# EAGLE design Power_cape (EAGLE 7.1.0)

## Sheet 1 of 3
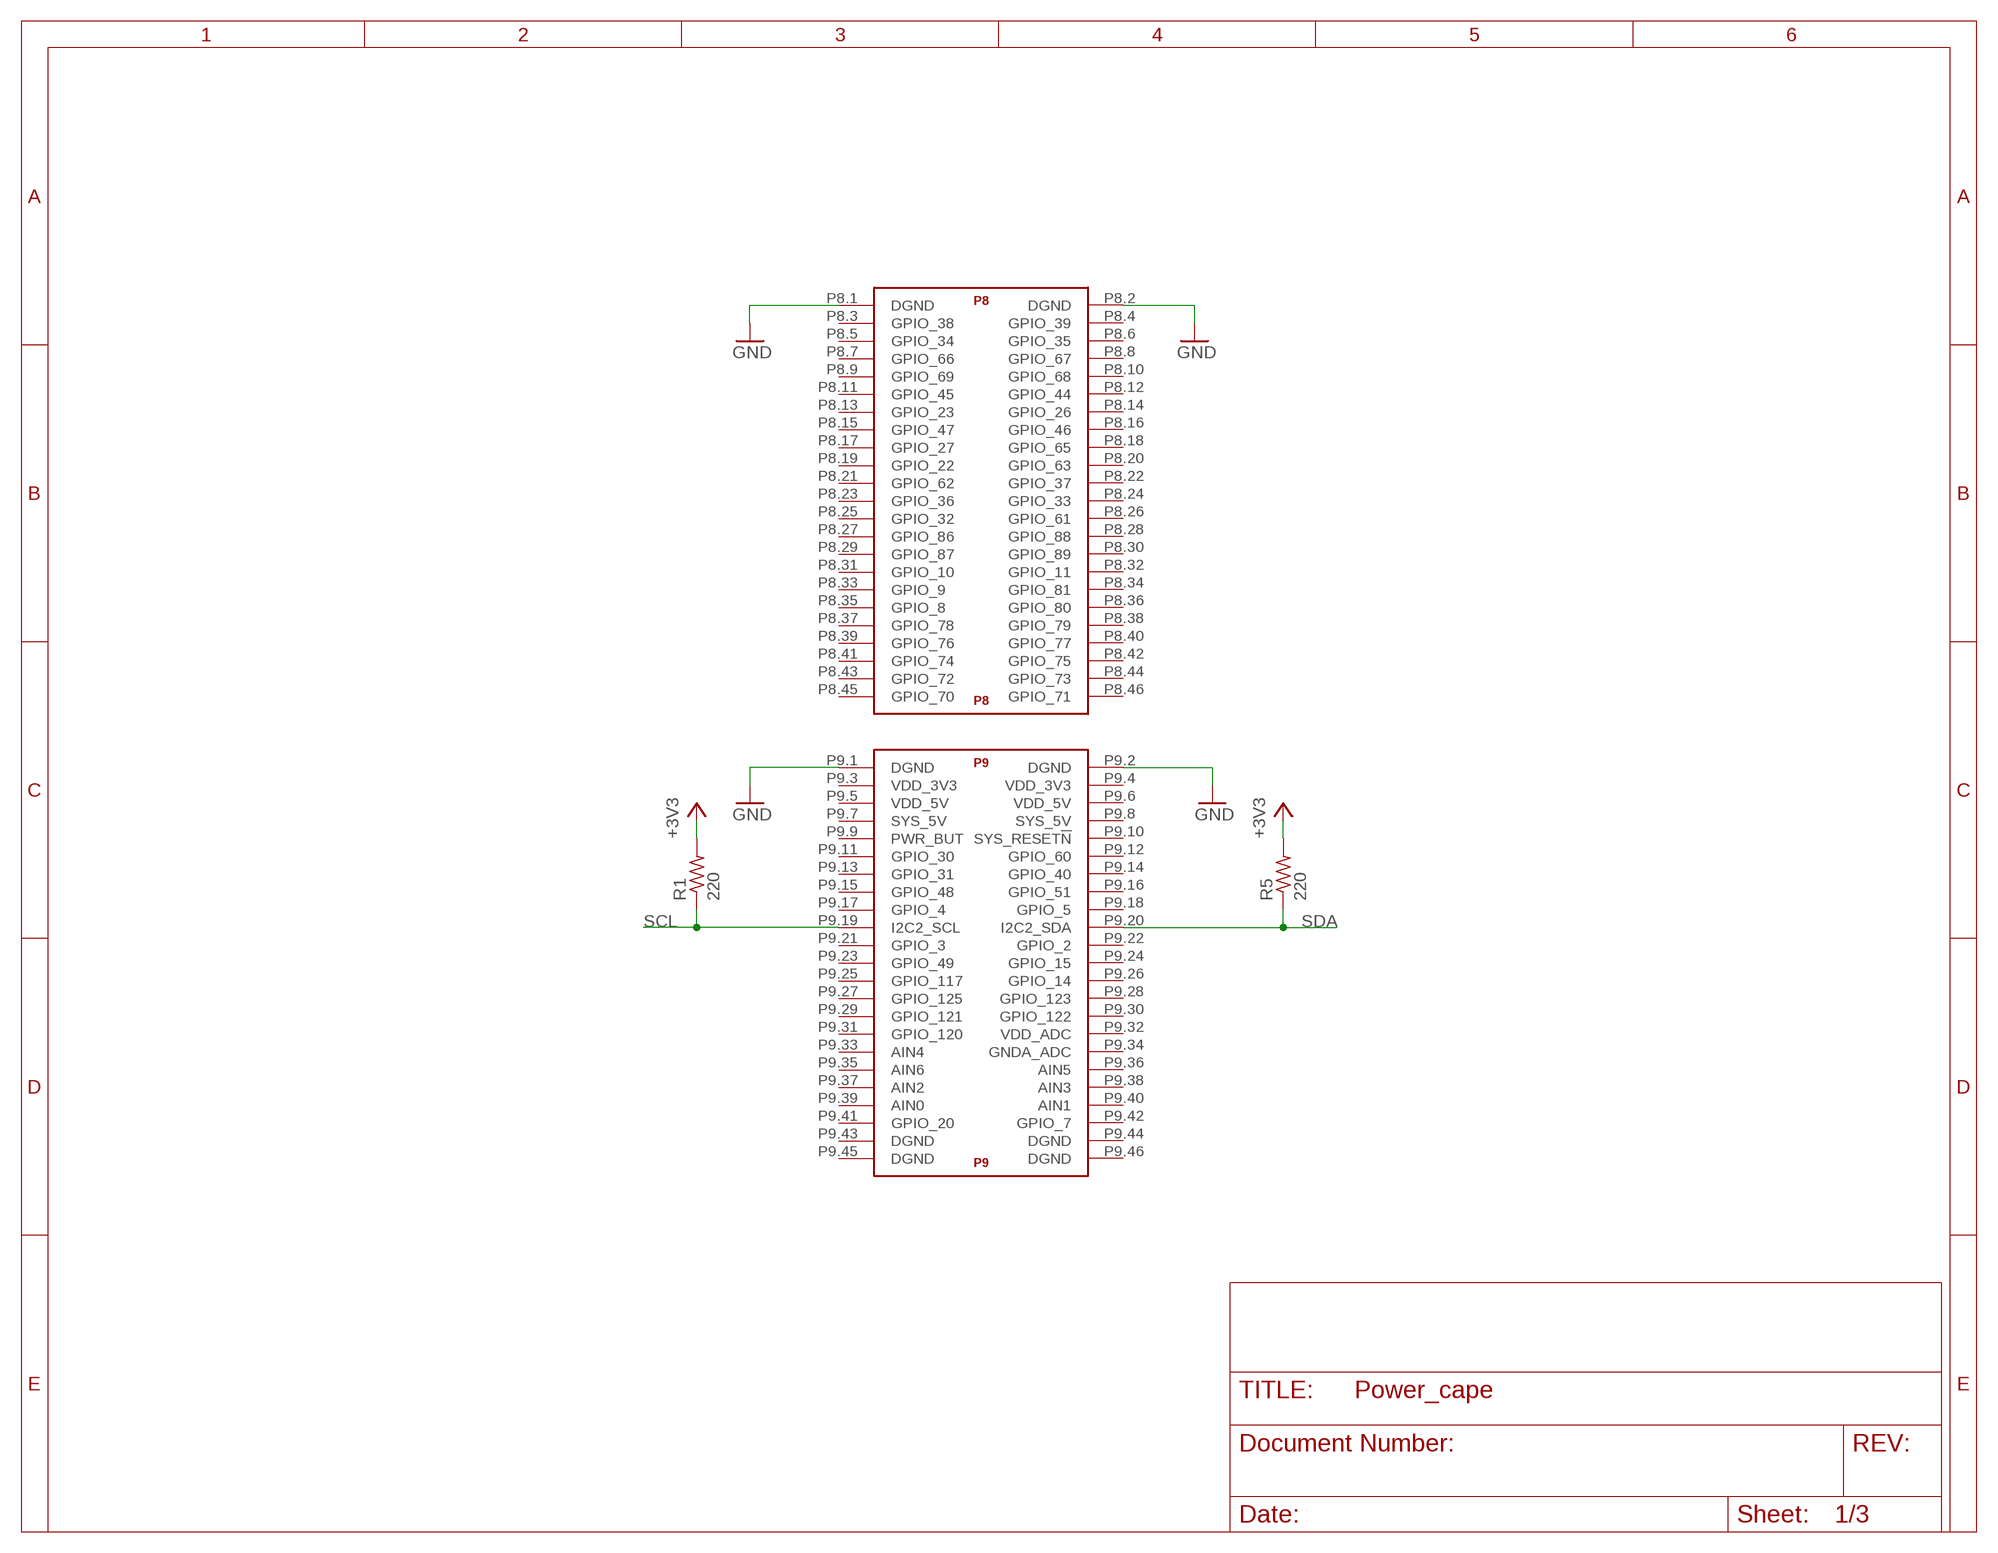
[diagram p0: schematic, sheet 1]

### Parts
R1  220  R-US_R0805W  [R0805W]
R5  220  R-US_R0805W  [R0805W]
U$1  BEAGLE_BONE_BLACK_CAPE  [BEAGLE_BONE_BLACK_CAPE]

### Nets
+3V3: R1.2 R5.2
GND: U$1.P8.1(P8:DGND) U$1.P8.2(P8:DGND) U$1.P9.1(P9:DGND) U$1.P9.2(P9:DGND) ; also sheet 2
SCL: R1.1 U$1.P9.19(P9:I2C2_SCL)
SDA: R5.1 U$1.P9.20(P9:I2C2_SDA)
Unconnected: U$1.P8.3(P8:GPIO_38) U$1.P8.4(P8:GPIO_39) U$1.P8.5(P8:GPIO_34) U$1.P8.6(P8:GPIO_35) U$1.P8.7(P8:GPIO_66) U$1.P8.8(P8:GPIO_67) U$1.P8.9(P8:GPIO_69) U$1.P8.10(P8:GPIO_68) U$1.P8.11(P8:GPIO_45) U$1.P8.12(P8:GPIO_44) U$1.P8.13(P8:GPIO_23) U$1.P8.14(P8:GPIO_26) U$1.P8.15(P8:GPIO_47) U$1.P8.16(P8:GPIO_46) U$1.P8.17(P8:GPIO_27) U$1.P8.18(P8:GPIO_65) U$1.P8.19(P8:GPIO_22) U$1.P8.20(P8:GPIO_63) U$1.P8.21(P8:GPIO_62) U$1.P8.22(P8:GPIO_37) U$1.P8.23(P8:GPIO_36) U$1.P8.24(P8:GPIO_33) U$1.P8.25(P8:GPIO_32) U$1.P8.26(P8:GPIO_61) U$1.P8.27(P8:GPIO_86) U$1.P8.28(P8:GPIO_88) U$1.P8.29(P8:GPIO_87) U$1.P8.30(P8:GPIO_89) U$1.P8.31(P8:GPIO_10) U$1.P8.32(P8:GPIO_11) U$1.P8.33(P8:GPIO_9) U$1.P8.34(P8:GPIO_81) U$1.P8.35(P8:GPIO_8) U$1.P8.36(P8:GPIO_80) U$1.P8.37(P8:GPIO_78) U$1.P8.38(P8:GPIO_79) U$1.P8.39(P8:GPIO_76) U$1.P8.40(P8:GPIO_77) U$1.P8.41(P8:GPIO_74) U$1.P8.42(P8:GPIO_75) U$1.P8.43(P8:GPIO_72) U$1.P8.44(P8:GPIO_73) U$1.P8.45(P8:GPIO_70) U$1.P8.46(P8:GPIO_71) U$1.P9.3(P9:VDD_3V3) U$1.P9.4(P9:VDD_3V3) U$1.P9.5(P9:VDD_5V) U$1.P9.6(P9:VDD_5V) U$1.P9.7(P9:SYS_5V) U$1.P9.8(P9:SYS_5V) U$1.P9.9(P9:PWR_BUT) U$1.P9.10(P9:SYS_RESET!N) U$1.P9.11(P9:GPIO_30) U$1.P9.12(P9:GPIO_60) U$1.P9.13(P9:GPIO_31) U$1.P9.14(P9:GPIO_40) U$1.P9.15(P9:GPIO_48) U$1.P9.16(P9:GPIO_51) U$1.P9.17(P9:GPIO_4) U$1.P9.18(P9:GPIO_5) U$1.P9.21(P9:GPIO_3) U$1.P9.22(P9:GPIO_2) U$1.P9.23(P9:GPIO_49) U$1.P9.24(P9:GPIO_15) U$1.P9.25(P9:GPIO_117) U$1.P9.26(P9:GPIO_14) U$1.P9.27(P9:GPIO_125) U$1.P9.28(P9:GPIO_123) U$1.P9.29(P9:GPIO_121) U$1.P9.30(P9:GPIO_122) U$1.P9.31(P9:GPIO_120) U$1.P9.32(P9:VDD_ADC) U$1.P9.33(P9:AIN4) U$1.P9.34(P9:GNDA_ADC) U$1.P9.35(P9:AIN6) U$1.P9.36(P9:AIN5) U$1.P9.37(P9:AIN2) U$1.P9.38(P9:AIN3) U$1.P9.39(P9:AIN0) U$1.P9.40(P9:AIN1) U$1.P9.41(P9:GPIO_20) U$1.P9.42(P9:GPIO_7) U$1.P9.43(P9:DGND) U$1.P9.44(P9:DGND) U$1.P9.45(P9:DGND) U$1.P9.46(P9:DGND)

## Sheet 2 of 3
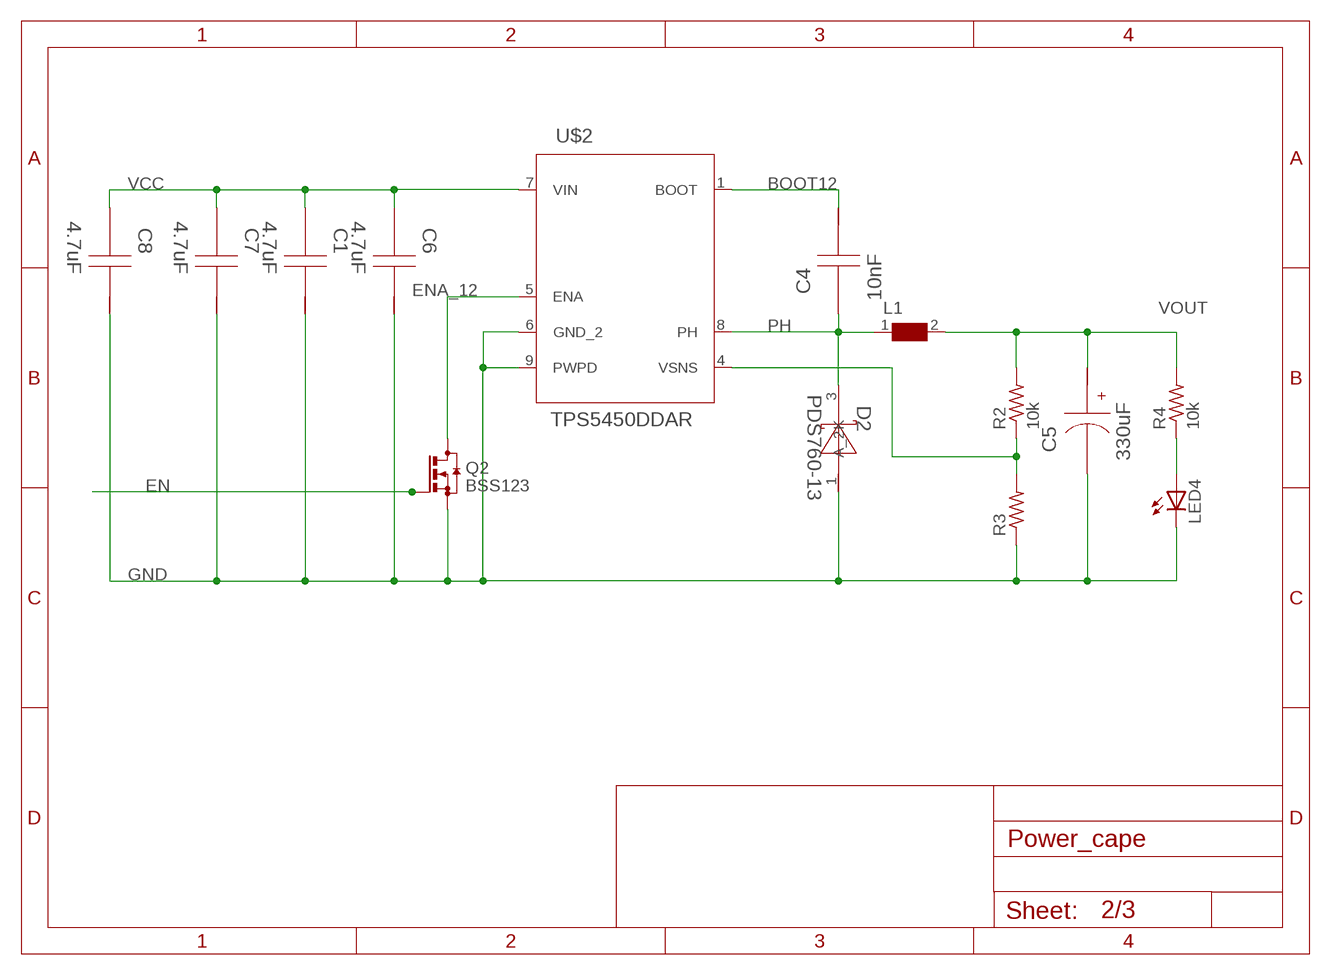
[diagram p1: schematic, sheet 2]

### Parts
C1  4.7uF  GRM31CR71H475KA12L  [1206]
C4  10nF  C0805C103K5RACTU  [0805]
C5  330uF  10SVP330MX  [SM_RADIAL_10AMM]
C6  4.7uF  GRM31CR71H475KA12L  [1206]
C7  4.7uF  GRM31CR71H475KA12L  [1206]
C8  4.7uF  GRM31CR71H475KA12L  [1206]
D2  PDS760-13  [POWERDI5]
L1  WE-HCC-7443331000_1090  [WE-HCC_1090]
LED4  LEDSML1206  [SML1206]
Q2  BSS123  [SOT23]
R2  10k  R-US_R1206  [R1206]
R3  R-US_R1206  [R1206]
R4  10k  R-US_R1206  [R1206]
U$2  TPS5450DDAR  [R-PDSO-G8]

### Nets
BOOT12: C4.1 U$2.1(BOOT)
EN: Q2.1(G)
ENA_12: Q2.3(D) U$2.5(ENA)
GND: C1.1 C5.2(-) C6.1 C7.1 C8.1 D2.1(A_2) LED4.C Q2.2(S) R3.1 U$2.6(GND_2) U$2.9(PWPD) ; also sheet 1
N$1: LED4.A R4.1
PH: C4.2 D2.3(K) L1.1 U$2.8(PH)
VCC: C1.2 C6.2 C7.2 C8.2 U$2.7(VIN)
VOUT: C5.1(+) L1.2 R2.2 R4.2
VSNS12: R2.1 R3.2 U$2.4(VSNS)

## Sheet 3 of 3

## Library data of the parts
C1 C6-C8 = 5v:GRM31CR71H475KA12L; CAP: 4.7E-6; ESR: 0.0; IRMS: 0.0; MANUFACTURER_NAME: MuRata; MANUFACTURER_PART_NUMBER: GRM31CR71H475KA12L; VDC: 50.0; VENDOR: MuRata
C4 = 5v:C0805C103K5RACTU; CAP: 1.0E-8; ESR: 1.739; IRMS: 0.411; MANUFACTURER_NAME: Kemet; MANUFACTURER_PART_NUMBER: C0805C103K5RACTU; VDC: 50.0; VENDOR: Kemet
C5 = 5v:10SVP330MX; CAP: 3.3E-4; DATASHEETURL: http://www.edc.sanyo.com/english/pdf/oscon/E32.pdf; ESR: 0.025; IRMS: 3.7; MANUFACTURER_NAME: Panasonic; MANUFACTURER_PART_NUMBER: 10SVP330MX; VDC: 10.0; VENDOR: Panasonic
D2 = 5v:PDS760-13; DATASHEETURL: www.diodes.com/datasheets/ds30477.pdf; IO: 7.0; MANUFACTURER_NAME: Diodes Inc.; MANUFACTURER_PART_NUMBER: PDS760-13; VENDOR: Diodes Inc.; VFATIO: 0.56; VRRM: 60.0
L1 = WE-HCC:WE-HCC: SMD High Current Cube Inductor WE-HCC - magnetically shieled - current capability up to 27A - excellent saturation characteristics -- filter choke for DC/DC converter -- single and polyphase buck converter -- filter choke for motor electronics; MPN: 7443331000; OC_FARNELL: 1848254; OC_NEWARK: 13T9771; PACKAGE: 1090; SUPPLIER: Wuerth Elektronik
LED4 = led:LED: LED OSRAM: - CHIPLED LG R971, LG N971, LY N971, LG Q971, LY Q971, LO R971, LY R971 LH N974, LH R974 LS Q976, LO Q976, LY Q976 LO Q996 - Hyper CHIPLED LW Q18S LB Q993, LB Q99A, LB R99A - SideLED LS A670, LO A670, LY A670, LG A670, LP A670 LB A673, LV A673, LT A673, LW A673 LH A674 LY A675 LS A676, LA A676, LO A676, LY A676, LW A676 LS A679, LY A679, LG A679 - Hyper Micro SIDELED® LS Y876, LA Y876, LO Y876, LY Y876 LT Y87S - SmartLED LW L88C, LW L88S LB L89C, LB L89S, LG L890 LS L89K, LO L89K, LY L89K LS L896, LA L896, LO L896, LY L896 - TOPLED LS T670, LO T670, LY T670, LG T670, LP T670 LSG T670, LSP T670, LSY T670, LOP T670, LYG T670 LG T671, LOG T671, LSG T671 LB T673, LV T673, LT T673, LW T673 LH T674 LS T676, LA T676, LO T676, LY T676, LB T676, LH T676, LSB T676, LW T676 LB T67C, LV T67C, LT T67C, LS T67K, LO T67K, LY T67K, LW E67C LS E67B, LA E67B, LO E67B, LY E67B, LB E67C, LV E67C, LT E67C LW T67C LS T679, LY T679, LG T679 LS T770, LO T770, LY T770, LG T770, LP T770 LB T773, LV T773, LT T773, LW T773 LH T774 LS E675, LA E675, LY E675, LS T675 LS T776, LA T776, LO T776, LY T776, LB T776 LHGB T686 LT T68C, LB T68C - Hyper Mini TOPLED® LB M676 - Mini TOPLED Santana® LG M470 LS M47K, LO M47K, LY M47K Source: http://www.osram.convergy.de LUXEON: - LUMILED® LXK2-PW12-R00, LXK2-PW12-S00, LXK2-PW14-U00, LXK2-PW14-V00 LXK2-PM12-R00, LXK2-PM12-S00, LXK2-PM14-U00 LXK2-PE12-Q00, LXK2-PE12-R00, LXK2-PE12-S00, LXK2-PE14-T00, LXK2-PE14-U00 LXK2-PB12-K00, LXK2-PB12-L00, LXK2-PB12-M00, LXK2-PB14-N00, LXK2-PB14-P00, LXK2-PB14-Q00 LXK2-PR12-L00, LXK2-PR12-M00, LXK2-PR14-Q00, LXK2-PR14-R00 LXK2-PD12-Q00, LXK2-PD12-R00, LXK2-PD12-S00 LXK2-PH12-R00, LXK2-PH12-S00 LXK2-PL12-P00, LXK2-PL12-Q00, LXK2-PL12-R00 Source: www.luxeon.com KINGBRIGHT: KA-3528ASYC Source: www.kingbright.com
Q2 = transistor-small-signal:BSS123: N-CHANNEL MOS FET
R1-R5 = rcl:R-US_: RESISTOR, American symbol
U$1 = SparkFun-Boards:BEAGLE_BONE_BLACK_CAPE
U$2 = 5v:TPS5450DDAR; DATASHEETURL: http://www.ti.com/product/tps5450; FREQUENCY: 500000.0; IMAX: 5.0; MANUFACTURER_NAME: Texas Instruments; MANUFACTURER_PART_NUMBER: TPS5450DDA; MKTG_PACKAGE: TPS5450; NSID: TPS5450DDAR; PACKAGE: TPS5450; VENDOR: Texas Instruments

## Net classes
0 default: width 0.203 mm, drill 0.483 mm, clearance 0.254 mm

## Board
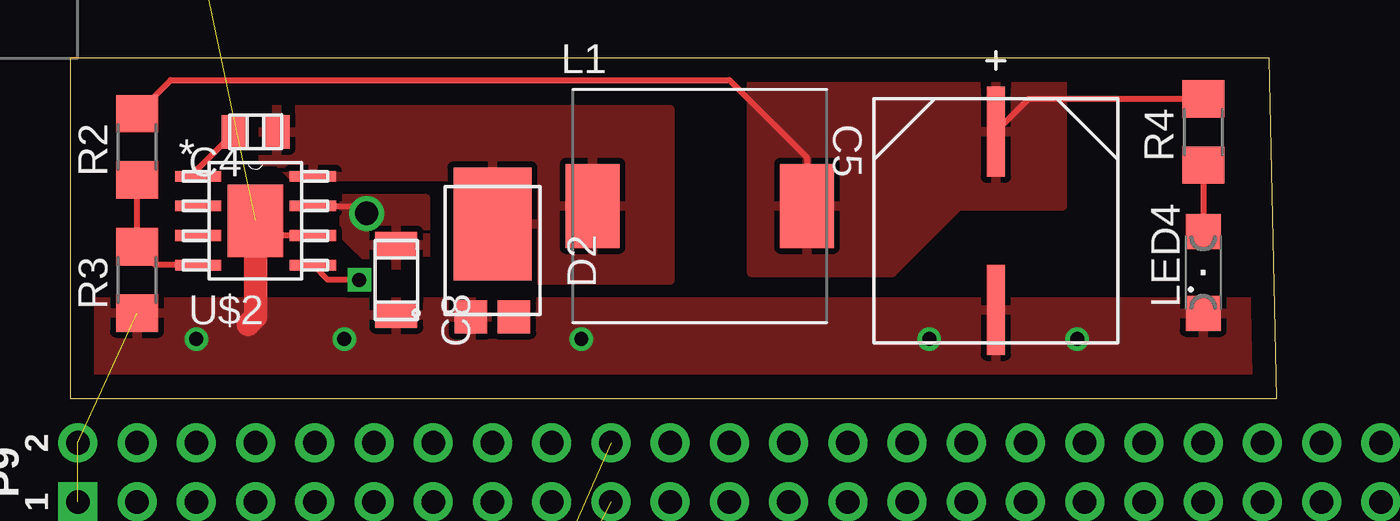
[diagram p2: board, top side]
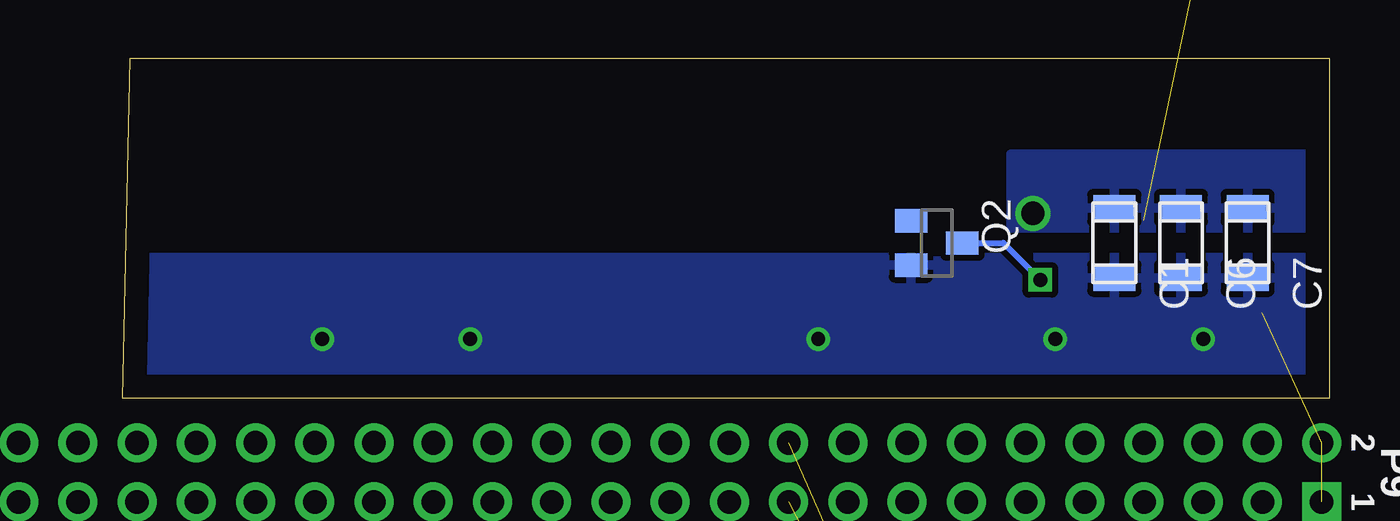
[diagram p3: board, bottom side, seen from below]

Size 51.73 x 14.59 mm. Coordinates in mm from the lower left corner, seen from the top.
Outline: 0,0 51.73,0 51.42,14.59 0,14.59 0,0
Copper layers (1*16): Top 0.035mm / dielectric 1.5mm / Bottom 0.035mm
Design rules "default": minimum track width 10mil, minimum drill 24mil, track to track 8mil, track to pad 8mil, pad to pad 8mil, via to via 8mil, smd to smd 8mil, copper to edge 40mil, drill to drill 8mil, minimum pad ring 10mil, minimum via ring 8mil, stop-mask expansion 4mil, vias tented up to drill 0mil, thermal gap 10mil

### Footprints (pad centres in the part's own frame; a part is rotated, then mirrored left to right if it is on the bottom)
1206 = smd 1.118 x 1.803: 1 -1.499,0; 2 1.499,0
0805 = smd 1.118 x 1.448: 1 -0.902,0; 2 0.902,0
SM_RADIAL_10AMM = smd 3.861 x 0.787: 1 -3.823,0; 2 3.823,0
POWERDI5 = smd 1.397 x 1.397: 1 -0.92,-2.857; 2 0.92,-2.857 | smd 3.353 x 4.851: 3 0,1.13
WE-HCC_1090 = smd 2.3 x 3.6: 1 -4.6,0; 2 4.6,0
SML1206 = smd 1.5 x 1.5: A 1.75,0; C -1.75,0
SOT23 = smd 1 x 1.4: 1 -0.95,-1.1; 2 0.95,-1.1; 3 0,1.1
R0805W = smd 1.5 x 1: 1 -1.052,0; 2 1.052,0
R1206 = smd 1.6 x 1.803: 1 -1.422,0; 2 1.422,0
BEAGLE_BONE_BLACK_CAPE = drill 1.016 pad 1.676 square: P8.1 20.32,50.165; P9.1 20.32,1.905 | drill 1.016 pad 1.676: P8.2 20.32,52.705; P8.3 22.86,50.165; P8.4 22.86,52.705; P8.5 25.4,50.165; P8.6 25.4,52.705; P8.7 27.94,50.165; P8.8 27.94,52.705; P8.9 30.48,50.165; P8.10 30.48,52.705; P8.11 33.02,50.165; P8.12 33.02,52.705; P8.13 35.56,50.165; P8.14 35.56,52.705; P8.15 38.1,50.165; P8.16 38.1,52.705; P8.17 40.64,50.165; P8.18 40.64,52.705; P8.19 43.18,50.165; P8.20 43.18,52.705; P8.21 45.72,50.165; P8.22 45.72,52.705; P8.23 48.26,50.165; P8.24 48.26,52.705; P8.25 50.8,50.165; P8.26 50.8,52.705; P8.27 53.34,50.165; P8.28 53.34,52.705; P8.29 55.88,50.165; P8.30 55.88,52.705; P8.31 58.42,50.165; P8.32 58.42,52.705; P8.33 60.96,50.165; P8.34 60.96,52.705; P8.35 63.5,50.165; P8.36 63.5,52.705; P8.37 66.04,50.165; P8.38 66.04,52.705; P8.40 68.58,52.705; P8.41 71.12,50.165; P8.42 71.12,52.705; P8.43 73.66,50.165; P8.44 73.66,52.705; P8.45 76.2,50.165; P8.46 76.2,52.705; P9.2 20.32,4.445; P9.3 22.86,1.905; P9.4 22.86,4.445; P9.5 25.4,1.905; P9.6 25.4,4.445; P9.7 27.94,1.905; P9.8 27.94,4.445; P9.9 30.48,1.905; P9.10 30.48,4.445; P9.11 33.02,1.905; P9.12 33.02,4.445; P9.13 35.56,1.905; P9.14 35.56,4.445; P9.15 38.1,1.905; P9.16 38.1,4.445; P9.17 40.64,1.905; P9.18 40.64,4.445; P9.19 43.18,1.905; P9.20 43.18,4.445; P9.21 45.72,1.905; P9.22 45.72,4.445; P9.23 48.26,1.905; P9.24 48.26,4.445; P9.25 50.8,1.905; P9.26 50.8,4.445; P9.27 53.34,1.905; P9.28 53.34,4.445; P9.29 55.88,1.905; P9.30 55.88,4.445; P9.31 58.42,1.905; P9.32 58.42,4.445; P9.33 60.96,1.905; P9.34 60.96,4.445; P9.35 63.5,1.905; P9.36 63.5,4.445; P9.37 66.04,1.905; P9.38 66.04,4.445; P9.39 68.58,1.905; P9.40 68.58,4.445; P9.41 71.12,1.905; P9.42 71.12,4.445; P9.43 73.66,1.905; P9.44 73.66,4.445; P9.45 76.2,1.905; P9.46 76.2,4.445 | drill 1.016 pad 1.88: P8.39 68.58,50.165 | hole 3.175: 14.605,3.175; 80.645,6.35; 80.645,48.26; 14.605,51.435
R-PDSO-G8 = smd 1.981 x 0.457: 1 -2.464,1.905; 2 -2.464,0.635; 3 -2.464,-0.635; 4 -2.464,-1.905; 5 2.464,-1.905; 6 2.464,-0.635; 7 2.464,0.635; 8 2.464,1.905 | smd 2.388 x 3.099: 9 0,0

### Placement (x,y rotation side)
C1  9.21,6.67 90 bottom
C4  7.94,11.43 0 top
C5  39.69,7.62 270 top
C6  6.35,6.67 90 bottom
C7  3.49,6.67 90 bottom
C8  13.97,5.08 90 top
D2  18.1,6.35 0 top
L1  26.99,8.26 0 top
LED4  48.58,5.4 90 top
Q2  16.83,6.67 270 bottom
R1  -17.46,-85.09 0 top  (outside the outline)
R2  2.86,10.79 90 top
R3  2.86,5.08 90 top
R4  48.58,11.43 90 top
R5  -12.38,-85.09 0 top  (outside the outline)
U$1  -20,-6.35 0 top
U$2  7.94,7.62 0 top

### Tracks (layer width: path | path; a pad name or v marks a point on that pad's centre or on a via)
+3V3  (1 unrouted)
BOOT12
  Top 0.254: U$2.1 5.47,9.87 C4.1
ENA_12  (via drill 0.6)
  Top 0.254: v12.38,5.08 11.04,5.08 U$2.5
  Bottom 0.254: Q2.3 13.97,6.67 v12.38,5.08
GND  (via drill 0.6)  (4 unrouted)
  Top 0.254: U$2.6 7.94,6.99
  Top 1.016: U$2.9 7.94,6.99 7.94,3.49 7.62,3.18
  other vias: 5.4,2.54 11.75,2.54 21.91,2.54 36.83,2.54 43.18,2.54
  pour Bottom: 0.63,6.03 52.39,6.03 52.39,0 0.63,0
  pour Top: 0.63,4.13 52.39,4.13 52.39,0 0.63,0
N$1
  Top 0.254: R4.1 LED4.A
PH
  pour Top: 8.25,12.38 8.25,10.16 8.89,10.16 9.52,9.53 16.19,9.53 19.37,5.08 25.72,5.08 25.72,12.38
SCL  (1 unrouted)
SDA  (1 unrouted)
VCC  (via drill 1)
  Top 0.254: U$2.7 12.38,8.26 v12.7,7.94
  pour Bottom: 0.63,7.3 13.65,7.3 13.65,10.48 0.63,10.48
  pour Top: 11.75,6.99 11.75,8.57 15.24,8.57 15.24,5.71 13.02,5.71
VOUT
  Top 0.254: R2.2 4.29,13.65 28.26,13.65 31.59,10.32 L1.2 | C5.1 41.1,12.85 R4.2
  pour Top: 29.21,13.97 29.21,5.4 35.24,5.4 38.1,8.26 42.55,8.26 42.55,13.97
VSNS12
  Top 0.254: R2.1 R3.2 3.64,5.71 U$2.4